# EAGLE schematic control (EAGLE 9.2.2)
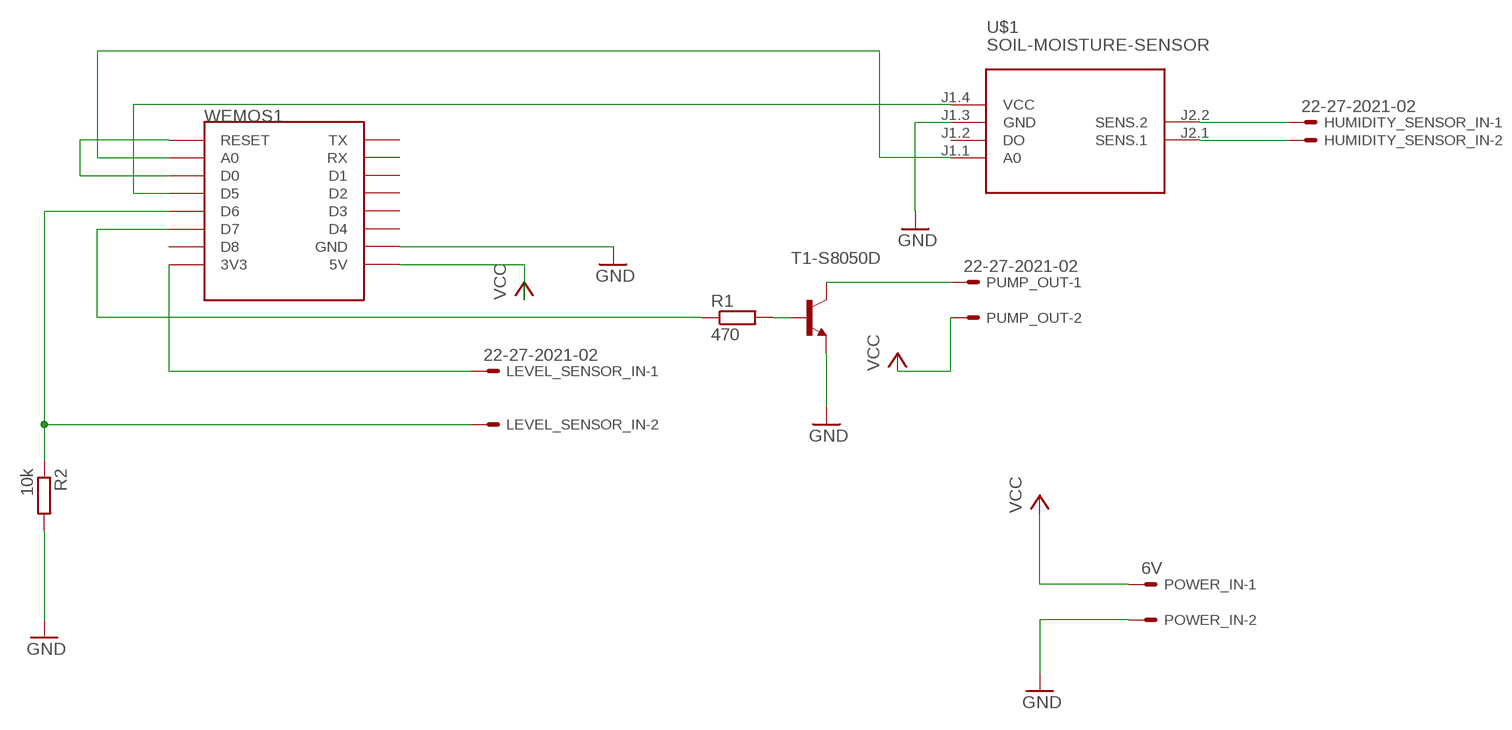
[diagram p0: schematic, sheet 1]

## Parts
HUMIDITY_SENSOR_IN  22-27-2021-02  [6410-02]
LEVEL_SENSOR_IN  22-27-2021-02  [6410-02]
POWER_IN  6V  22-27-2021-02  [6410-02]
PUMP_OUT  22-27-2021-02  [6410-02]
R1  470  R0204/7  [0204/7]
R2  10k  R0204/7  [0204/7]
T1-S8050D  -NPN-TO92  [TO92]
U$1  SOIL-MOISTURE-SENSOR  [SOIL-MOISTURE-SENSOR]
WEMOS1  WEMOS-D1-MINI  [WEMOS-D1-MINI]

## Nets
GND: POWER_IN.2 R2.2 T1-S8050D.1(E) U$1.J1.3(GND) WEMOS1.GND
GND_PUMP: PUMP_OUT.1 T1-S8050D.3(C)
HUMIDITY_SENSOR_LINE1: HUMIDITY_SENSOR_IN.1 U$1.J2.2(SENS.2)
HUMIDITY_SENSOR_LINE2: HUMIDITY_SENSOR_IN.2 U$1.J2.1(SENS.1)
LEVEL_SENSOR_LINE1: LEVEL_SENSOR_IN.2 R2.1 WEMOS1.D6
LEVEL_SENSOR_LINE2: LEVEL_SENSOR_IN.1 WEMOS1.3V3
N$1: R1.2 T1-S8050D.2(B)
N$2: U$1.J1.1(A0) WEMOS1.A0
N$3: R1.1 WEMOS1.D7
N$4: U$1.J1.4(VCC) WEMOS1.D5
N$5: WEMOS1.D0 WEMOS1.RESET
VCC: POWER_IN.1 PUMP_OUT.2 WEMOS1.5V
Unconnected: U$1.J1.2(DO) WEMOS1.D1 WEMOS1.D2 WEMOS1.D3 WEMOS1.D4 WEMOS1.D8 WEMOS1.RX WEMOS1.TX

## Library data of the parts
HUMIDITY_SENSOR_IN LEVEL_SENSOR_IN POWER_IN PUMP_OUT = con-molex:22-?-02: CONNECTOR wire to board 2.54 mm (.1 inch) pitch header; MF: MOLEX; OC_FARNELL: unknown; OC_NEWARK: unknown
R1 R2 = eagle-ltspice:R: RESISTOR, European symbol; SPICEMODEL: NONE; SPICEPREFIX: R
T1-S8050D = transistor:*-NPN-: NPN Transistror BF959 corrected 2008.03.06
U$1 = diy-modules:SOIL-MOISTURE-SENSOR: Soil Moisture Sensor Click here to find device on ebay.com <http://www.ebay.com/sch/soil+moisture+sensor+arduino>
WEMOS1 = esp8266modules:WEMOS-D1-MINI: WeMos.cc D1 mini ESP8266 module